# EAGLE schematic imxrt1062-som (EAGLE 9.6.2)

## Sheet 1 of 2
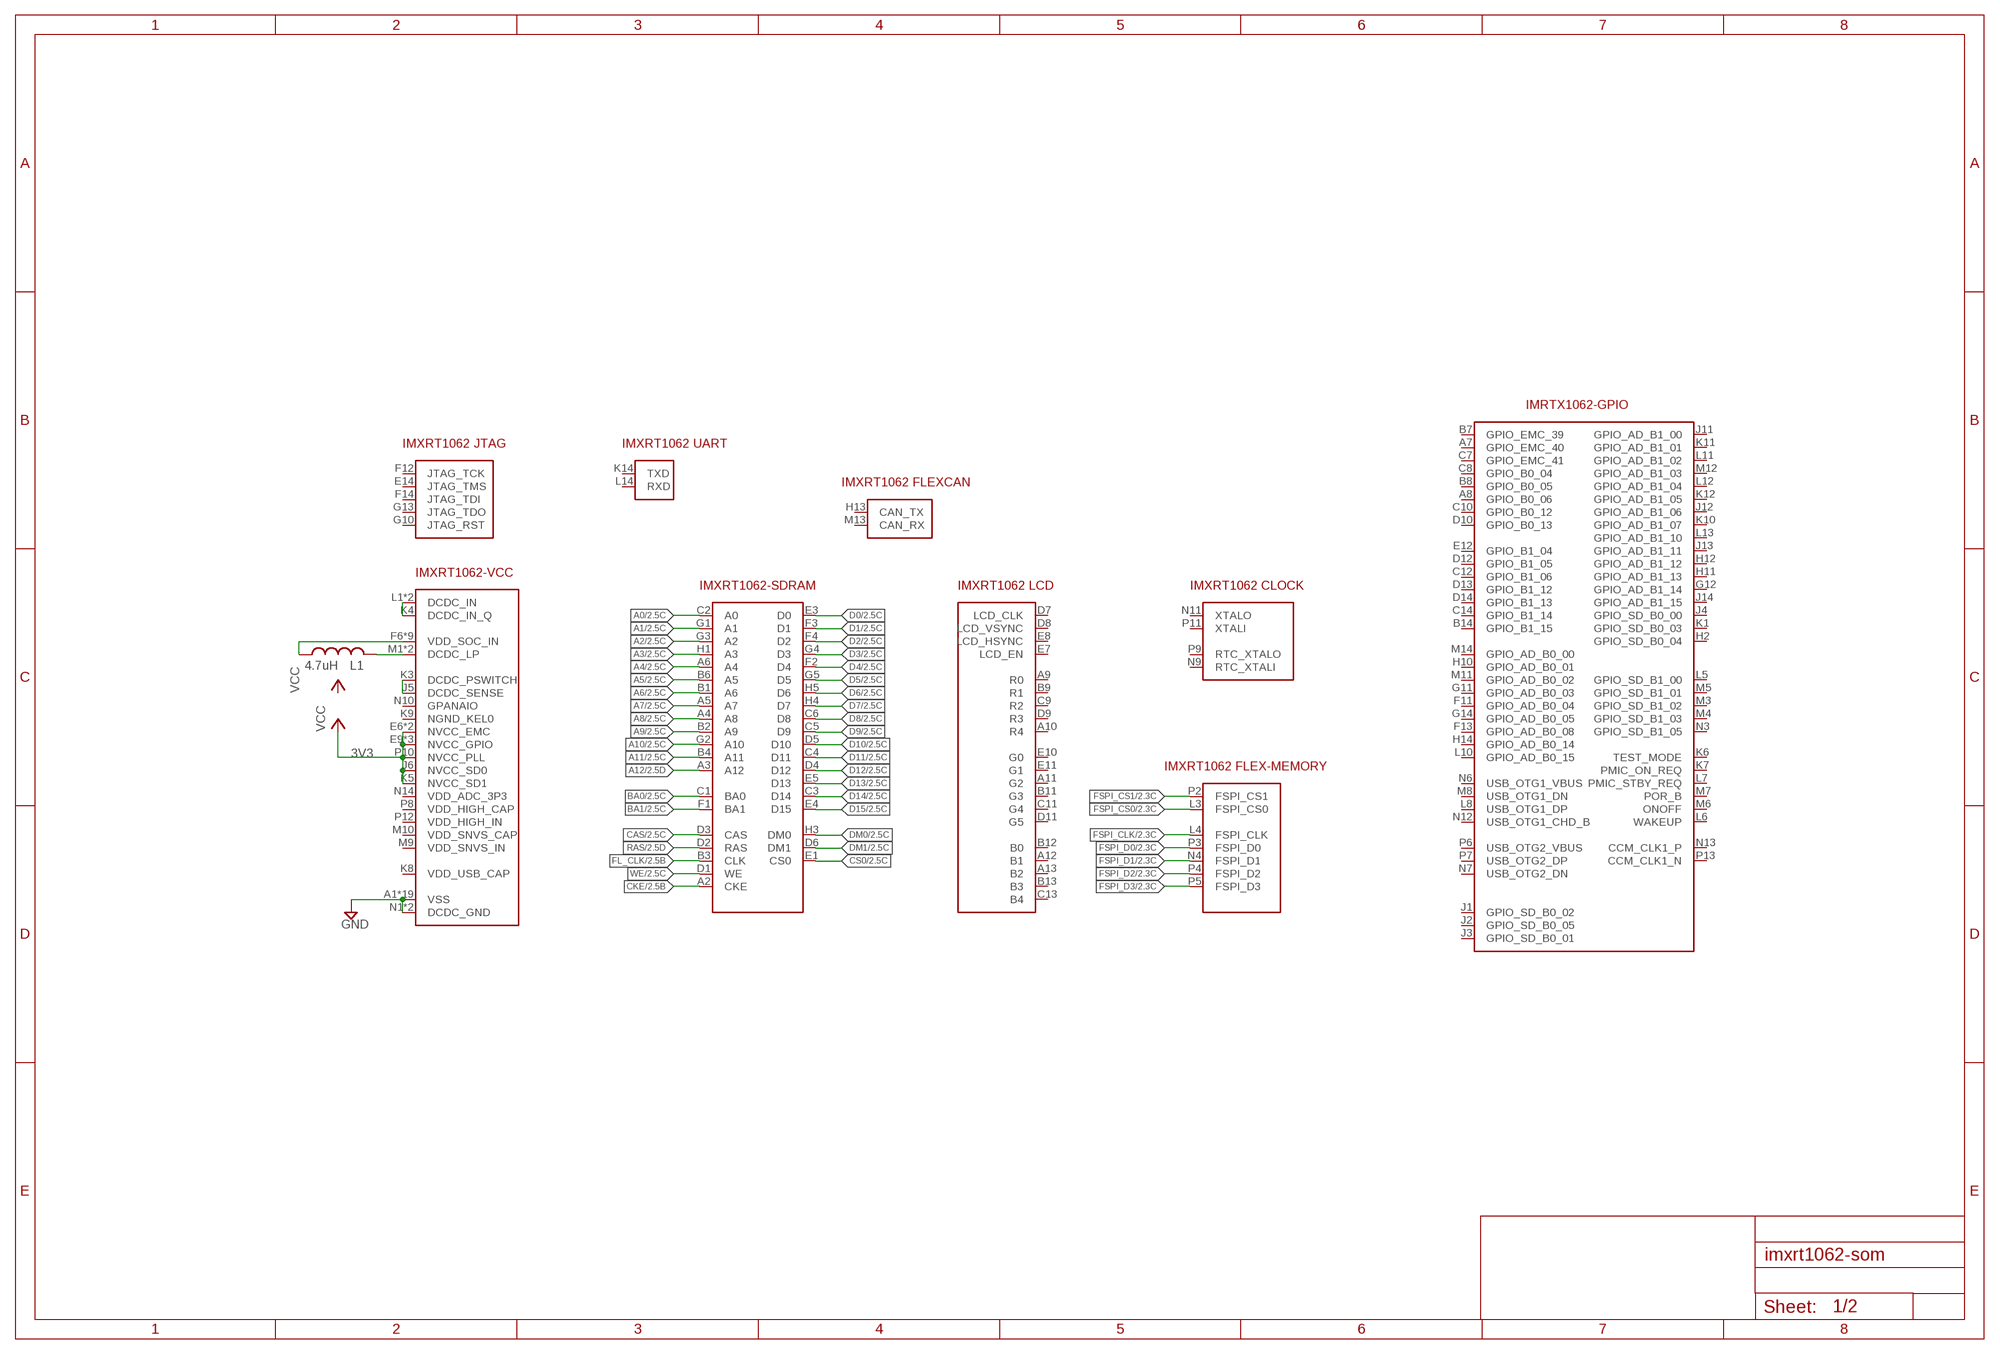
[diagram p0: schematic, sheet 1]

### Parts
L1  4.7uH  L-USL0201  [L0201]
U$1  IMXRT1062DV_V2  [IMXRT1062]

### Nets
3V3: U$1.E6(NVCC_EMC) U$1.E9(NVCC_GPIO) U$1.F5(NVCC_EMC) U$1.F10(NVCC_GPIO) U$1.J6(NVCC_SD0) U$1.J10(NVCC_GPIO) U$1.K5(NVCC_SD1) U$1.P10(NVCC_PLL) ; supply symbol labelled VCC ; also sheet 2
A0: U$1.C2(A0) ; also sheet 2
A1: U$1.G1(A1) ; also sheet 2
A2: U$1.G3(A2) ; also sheet 2
A3: U$1.H1(A3) ; also sheet 2
A4: U$1.A6(A4) ; also sheet 2
A5: U$1.B6(A5) ; also sheet 2
A6: U$1.B1(A6) ; also sheet 2
A7: U$1.A5(A7) ; also sheet 2
A8: U$1.A4(A8) ; also sheet 2
A9: U$1.B2(A9) ; also sheet 2
A10: U$1.G2(A10) ; also sheet 2
A11: U$1.B4(A11) ; also sheet 2
A12: U$1.A3(A12) ; also sheet 2
BA0: U$1.C1(BA0) ; also sheet 2
BA1: U$1.F1(BA1) ; also sheet 2
CAS: U$1.D3(CAS) ; also sheet 2
CKE: U$1.A2(CKE) ; also sheet 2
CS0: U$1.E1(CS0) ; also sheet 2
D0: U$1.E3(D0) ; also sheet 2
D1: U$1.F3(D1) ; also sheet 2
D2: U$1.F4(D2) ; also sheet 2
D3: U$1.G4(D3) ; also sheet 2
D4: U$1.F2(D4) ; also sheet 2
D5: U$1.G5(D5) ; also sheet 2
D6: U$1.H5(D6) ; also sheet 2
D7: U$1.H4(D7) ; also sheet 2
D8: U$1.C6(D8) ; also sheet 2
D9: U$1.C5(D9) ; also sheet 2
D10: U$1.D5(D10) ; also sheet 2
D11: U$1.C4(D11) ; also sheet 2
D12: U$1.D4(D12) ; also sheet 2
D13: U$1.E5(D13) ; also sheet 2
D14: U$1.C3(D14) ; also sheet 2
D15: U$1.E4(D15) ; also sheet 2
DM0: U$1.H3(DM0) ; also sheet 2
DM1: U$1.D6(DM1) ; also sheet 2
FL_CLK: U$1.B3(CLK) ; also sheet 2
FSPI_CLK: U$1.L4(FSPI_CLK) ; also sheet 2
FSPI_CS0: U$1.L3(FSPI_CS0) ; also sheet 2
FSPI_CS1: U$1.P2(FSPI_CS1) ; also sheet 2
FSPI_D0: U$1.P3(FSPI_D0) ; also sheet 2
FSPI_D1: U$1.N4(FSPI_D1) ; also sheet 2
FSPI_D2: U$1.P4(FSPI_D2) ; also sheet 2
FSPI_D3: U$1.P5(FSPI_D3) ; also sheet 2
GND: U$1.A1(VSS) U$1.A14(VSS) U$1.B5(VSS) U$1.B10(VSS) U$1.E2(VSS) U$1.E13(VSS) U$1.G7(VSS) U$1.G8(VSS) U$1.H7(VSS) U$1.H8(VSS) U$1.J7(VSS) U$1.J8(VSS) U$1.K2(VSS) U$1.K13(VSS) U$1.L9(VSS) U$1.N1(DCDC_GND) U$1.N2(DCDC_GND) U$1.N5(VSS) U$1.N8(VSS) U$1.P1(VSS) U$1.P14(VSS) ; also sheet 2
N$1: U$1.K4(DCDC_IN_Q) U$1.L1(DCDC_IN) U$1.L2(DCDC_IN)
N$2: U$1.J5(DCDC_SENSE) U$1.K3(DCDC_PSWITCH)
N$3: L1.2 U$1.M1(DCDC_LP) U$1.M2(DCDC_LP)
N$4: L1.1 U$1.F6(VDD_SOC_IN) U$1.F7(VDD_SOC_IN) U$1.F8(VDD_SOC_IN) U$1.F9(VDD_SOC_IN) U$1.G6(VDD_SOC_IN) U$1.G9(VDD_SOC_IN) U$1.H6(VDD_SOC_IN) U$1.H9(VDD_SOC_IN) U$1.J9(VDD_SOC_IN)
RAS: U$1.D2(RAS) ; also sheet 2
WE: U$1.D1(WE) ; also sheet 2
Unconnected: U$1.A7(GPIO_EMC_40) U$1.A8(GPIO_B0_06) U$1.A9(R0) U$1.A10(R4) U$1.A11(G2) U$1.A12(B1) U$1.A13(B2) U$1.B7(GPIO_EMC_39) U$1.B8(GPIO_B0_05) U$1.B9(R1) U$1.B11(G3) U$1.B12(B0) U$1.B13(B3) U$1.B14(GPIO_B1_15) U$1.C7(GPIO_EMC_41) U$1.C8(GPIO_B0_04) U$1.C9(R2) U$1.C10(GPIO_B0_12) U$1.C11(G4) U$1.C12(GPIO_B1_06) U$1.C13(B4) U$1.C14(GPIO_B1_14) U$1.D7(LCD_CLK) U$1.D8(LCD_VSYNC) U$1.D9(R3) U$1.D10(GPIO_B0_13) U$1.D11(G5) U$1.D12(GPIO_B1_05) U$1.D13(GPIO_B1_12) U$1.D14(GPIO_B1_13) U$1.E7(LCD_EN) U$1.E8(LCD_HSYNC) U$1.E10(G0) U$1.E11(G1) U$1.E12(GPIO_B1_04) U$1.E14(JTAG_TMS) U$1.F11(GPIO_AD_B0_04) U$1.F12(JTAG_TCK) U$1.F13(GPIO_AD_B0_08) U$1.F14(JTAG_TDI) U$1.G10(JTAG_RST) U$1.G11(GPIO_AD_B0_03) U$1.G12(GPIO_AD_B1_14) U$1.G13(JTAG_TDO) U$1.G14(GPIO_AD_B0_05) U$1.H2(GPIO_SD_B0_04) U$1.H10(GPIO_AD_B0_01) U$1.H11(GPIO_AD_B1_13) U$1.H12(GPIO_AD_B1_12) U$1.H13(CAN_TX) U$1.H14(GPIO_AD_B0_14) U$1.J1(GPIO_SD_B0_02) U$1.J2(GPIO_SD_B0_05) U$1.J3(GPIO_SD_B0_01) U$1.J4(GPIO_SD_B0_00) U$1.J11(GPIO_AD_B1_00) U$1.J12(GPIO_AD_B1_06) U$1.J13(GPIO_AD_B1_11) U$1.J14(GPIO_AD_B1_15) U$1.K1(GPIO_SD_B0_03) U$1.K6(TEST_MODE) U$1.K7(PMIC_ON_REQ) U$1.K10(GPIO_AD_B1_07) U$1.K11(GPIO_AD_B1_01) U$1.K12(GPIO_AD_B1_05) U$1.K14(TXD) U$1.L5(GPIO_SD_B1_00) U$1.L6(WAKEUP) U$1.L7(PMIC_STBY_REQ) U$1.L8(USB_OTG1_DP) U$1.L10(GPIO_AD_B0_15) U$1.L11(GPIO_AD_B1_02) U$1.L12(GPIO_AD_B1_04) U$1.L13(GPIO_AD_B1_10) U$1.L14(RXD) U$1.M3(GPIO_SD_B1_02) U$1.M4(GPIO_SD_B1_03) U$1.M5(GPIO_SD_B1_01) U$1.M6(ONOFF) U$1.M7(POR_B) U$1.M8(USB_OTG1_DN) U$1.M11(GPIO_AD_B0_02) U$1.M12(GPIO_AD_B1_03) U$1.M13(CAN_RX) U$1.M14(GPIO_AD_B0_00) U$1.N3(GPIO_SD_B1_05) U$1.N6(USB_OTG1_VBUS) U$1.N7(USB_OTG2_DN) U$1.N9(RTC_XTALI) U$1.N11(XTALO) U$1.N12(USB_OTG1_CHD_B) U$1.N13(CCM_CLK1_P) U$1.P6(USB_OTG2_VBUS) U$1.P7(USB_OTG2_DP) U$1.P9(RTC_XTALO) U$1.P11(XTALI) U$1.P13(CCM_CLK1_N)

## Sheet 2 of 2
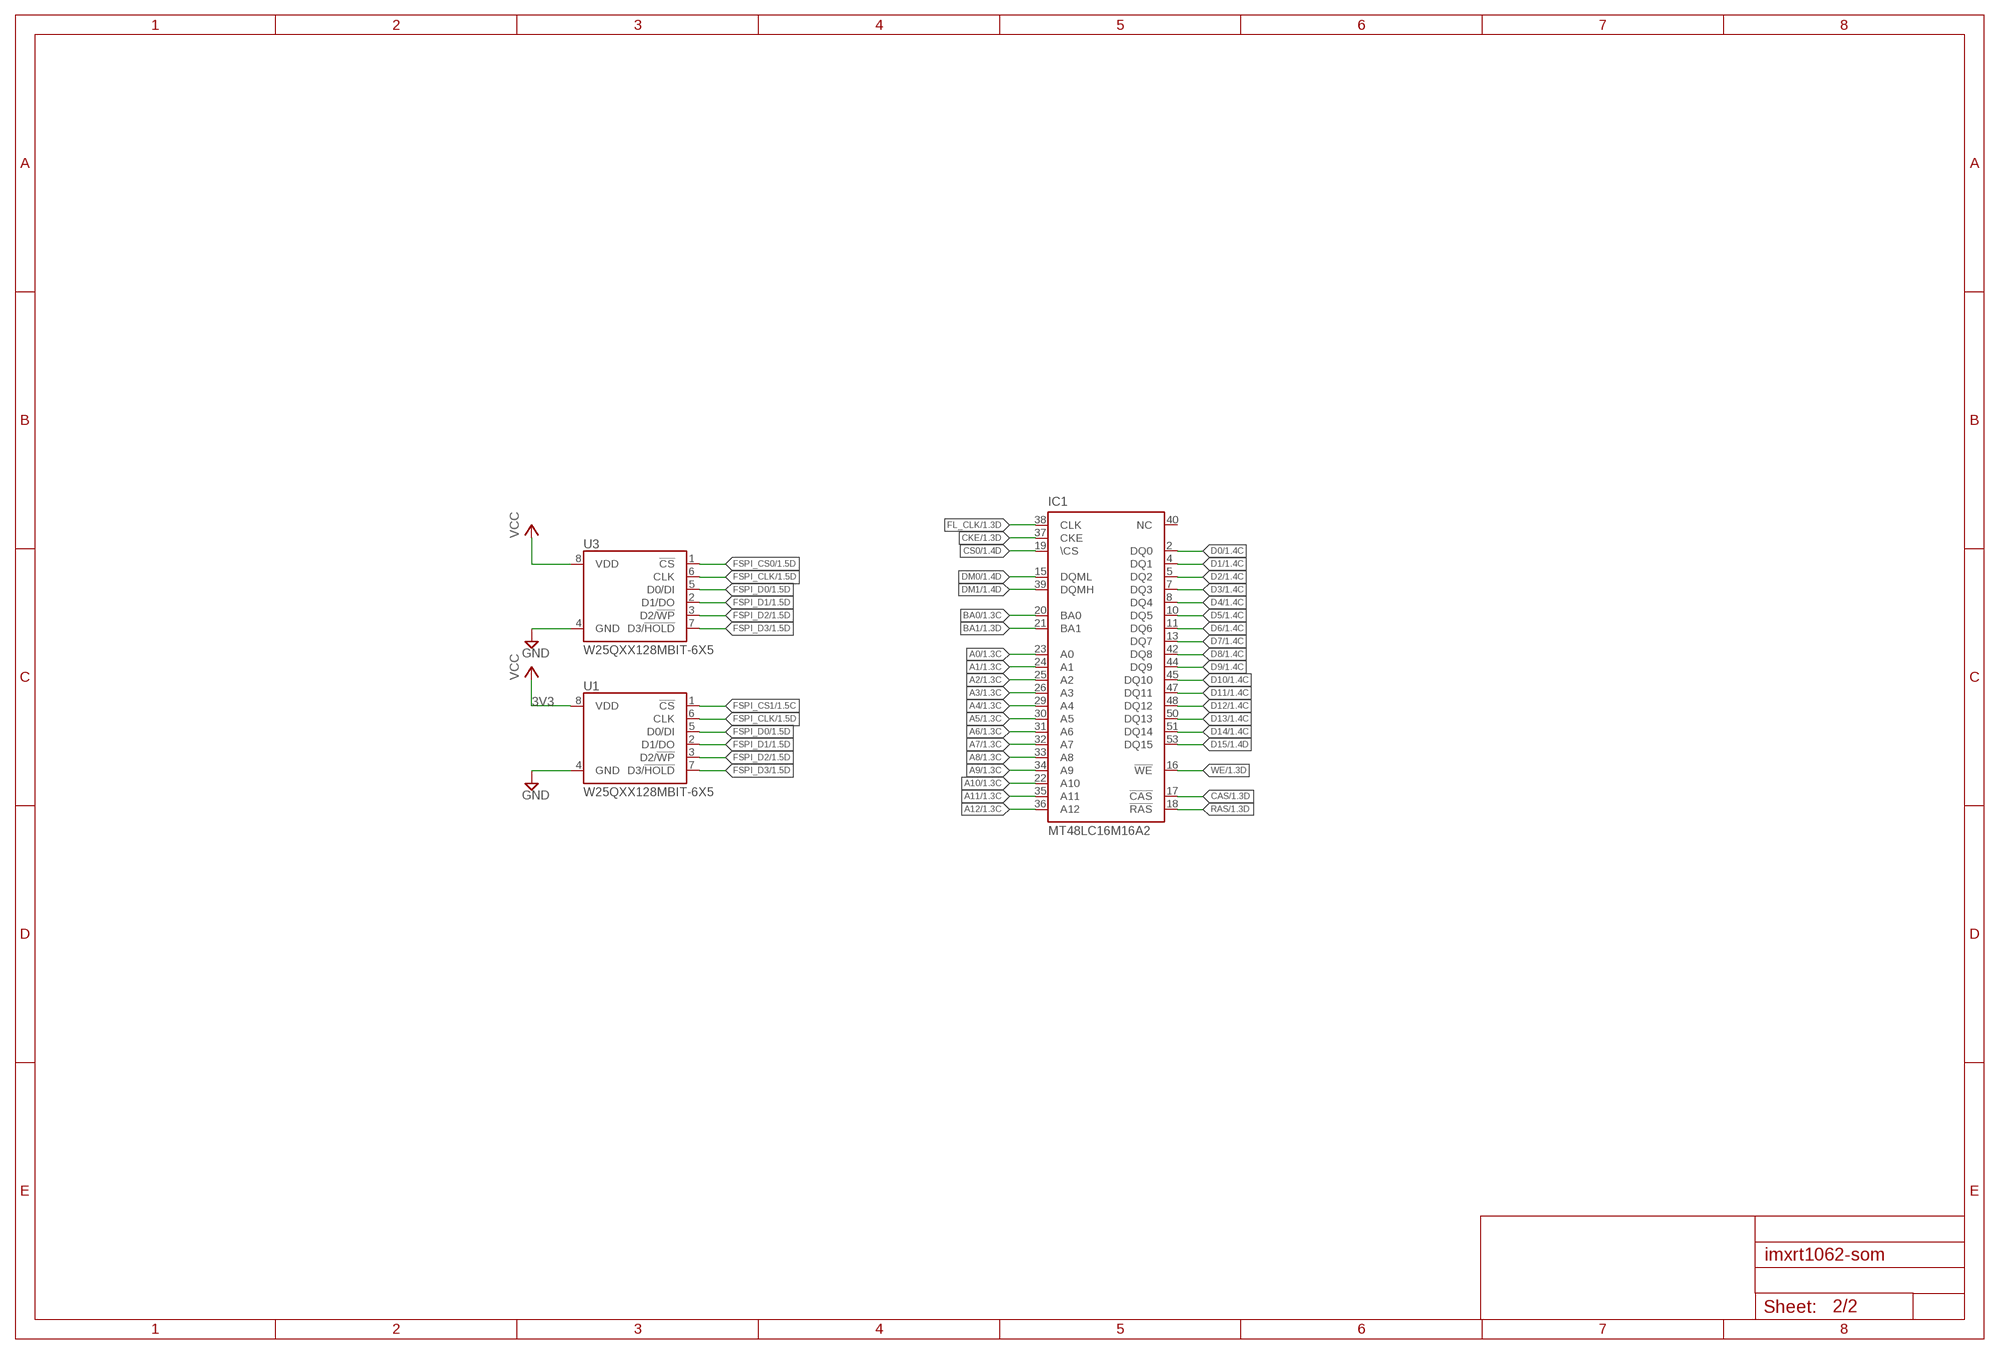
[diagram p1: schematic, sheet 2]

### Parts
IC1  MT48LC16M16A2  [TSOP54-400]
U1  W25QXX128MBIT-6X5  [WSON-8-6X5]
U3  W25QXX128MBIT-6X5  [WSON-8-6X5]

### Nets
A0: IC1.23(A0) ; also sheet 1
A1: IC1.24(A1) ; also sheet 1
A2: IC1.25(A2) ; also sheet 1
A3: IC1.26(A3) ; also sheet 1
A4: IC1.29(A4) ; also sheet 1
A5: IC1.30(A5) ; also sheet 1
A6: IC1.31(A6) ; also sheet 1
A7: IC1.32(A7) ; also sheet 1
A8: IC1.33(A8) ; also sheet 1
A9: IC1.34(A9) ; also sheet 1
A10: IC1.22(A10) ; also sheet 1
A11: IC1.35(A11) ; also sheet 1
A12: IC1.36(A12) ; also sheet 1
BA0: IC1.20(BA0) ; also sheet 1
BA1: IC1.21(BA1) ; also sheet 1
CAS: IC1.17(!CAS) ; also sheet 1
CKE: IC1.37(CKE) ; also sheet 1
CS0: IC1.19(\CS) ; also sheet 1
D0: IC1.2(DQ0) ; also sheet 1
D1: IC1.4(DQ1) ; also sheet 1
D2: IC1.5(DQ2) ; also sheet 1
D3: IC1.7(DQ3) ; also sheet 1
D4: IC1.8(DQ4) ; also sheet 1
D5: IC1.10(DQ5) ; also sheet 1
D6: IC1.11(DQ6) ; also sheet 1
D7: IC1.13(DQ7) ; also sheet 1
D8: IC1.42(DQ8) ; also sheet 1
D9: IC1.44(DQ9) ; also sheet 1
D10: IC1.45(DQ10) ; also sheet 1
D11: IC1.47(DQ11) ; also sheet 1
D12: IC1.48(DQ12) ; also sheet 1
D13: IC1.50(DQ13) ; also sheet 1
D14: IC1.51(DQ14) ; also sheet 1
D15: IC1.53(DQ15) ; also sheet 1
DM0: IC1.15(DQML) ; also sheet 1
DM1: IC1.39(DQMH) ; also sheet 1
FL_CLK: IC1.38(CLK) ; also sheet 1
FSPI_CLK: U1.6(CLK) U3.6(CLK) ; also sheet 1
FSPI_CS0: U3.1(!CS!) ; also sheet 1
FSPI_CS1: U1.1(!CS!) ; also sheet 1
FSPI_D0: U1.5(D0/DI) U3.5(D0/DI) ; also sheet 1
FSPI_D1: U1.2(D1/DO) U3.2(D1/DO) ; also sheet 1
FSPI_D2: U1.3(D2/!WP!) U3.3(D2/!WP!) ; also sheet 1
FSPI_D3: U1.7(D3/!HOLD!) U3.7(D3/!HOLD!) ; also sheet 1
GND: U1.4(GND) U3.4(GND) ; also sheet 1
RAS: IC1.18(!RAS) ; also sheet 1
VCC: U1.8(VDD) U3.8(VDD)
WE: IC1.16(!WE) ; also sheet 1
Unconnected: IC1.40(NC)

## Power pins joined to a net without a drawn wire
GPANAIO: U$1.N10(GPANAIO)
NGND_KEL0: U$1.K9(NGND_KEL0)
VDD: IC1.1(VDD) IC1.14(VDD) IC1.27(VDD)
VDD_ADC_3P3: U$1.N14(VDD_ADC_3P3)
VDD_HIGH_CAP: U$1.P8(VDD_HIGH_CAP)
VDD_HIGH_IN: U$1.P12(VDD_HIGH_IN)
VDD_SNVS_CAP: U$1.M10(VDD_SNVS_CAP)
VDD_SNVS_IN: U$1.M9(VDD_SNVS_IN)
VDD_USB_CAP: U$1.K8(VDD_USB_CAP)
VDDQ: IC1.3(VDDQ) IC1.9(VDDQ) IC1.43(VDDQ) IC1.49(VDDQ)
VSS: IC1.28(VSS) IC1.41(VSS) IC1.54(VSS)
VSSQ: IC1.6(VSSQ) IC1.12(VSSQ) IC1.46(VSSQ) IC1.52(VSSQ)

## Library data of the parts
IC1 = memory-micron:MT48LC16M16A2: 256Mb: x16 SDRAM MT48LC16M16A2 - 4 Meg x 16 x 4 banks Source: http://download.micron.com/pdf/datasheets/dram/sdram/256MSDRAM.pdf; OC_FARNELL: unknown; OC_NEWARK: unknown
L1 = rcl:L-US: INDUCTOR, American symbol; SPICEPREFIX: L
U1 U3 = SparkFun-IC-Memory:W25QXX; PROD_ID: IC-15107
U$1 = tft_display:IMXRT1062DV_V2